# EAGLE design rpi_shield (EAGLE 6.5.0)
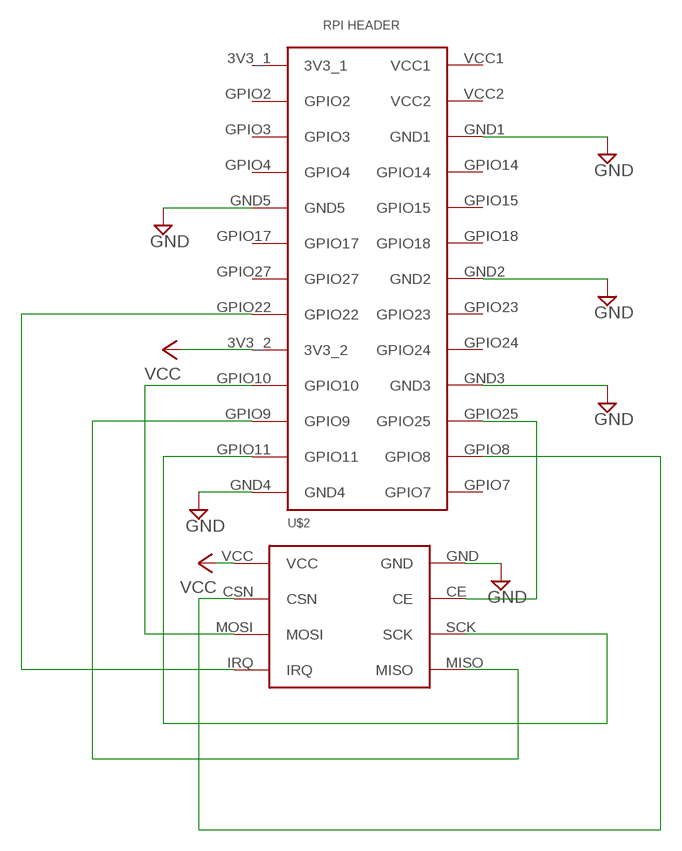
[diagram p0: schematic, sheet 1]

## Parts
U$1  RPI_HEADER  [RPI_HEADER]
U$2  NRF24L01_8P_ANTENNA  [NRF24L01_8P_ANTENNA]

## Nets
GND: U$1.GND1 U$1.GND2 U$1.GND3 U$1.GND4 U$1.GND5 U$2.GND
N$2: U$1.GPIO25 U$2.CE
N$4: U$1.GPIO11 U$2.SCK
N$5: U$1.GPIO9 U$2.MISO
N$6: U$1.GPIO10 U$2.MOSI
N$7: U$1.GPIO22 U$2.IRQ
N$8: U$1.GPIO8 U$2.CSN
VCC: U$1.3V3_2 U$2.VCC
Unconnected: U$1.3V3_1 U$1.GPIO2 U$1.GPIO3 U$1.GPIO4 U$1.GPIO7 U$1.GPIO14 U$1.GPIO15 U$1.GPIO17 U$1.GPIO18 U$1.GPIO23 U$1.GPIO24 U$1.GPIO27 U$1.VCC1 U$1.VCC2

## Library data of the parts
U$1 = piweather:RPI_HEADER
U$2 = piweather:NRF24L01_8P_ANTENNA

## Board
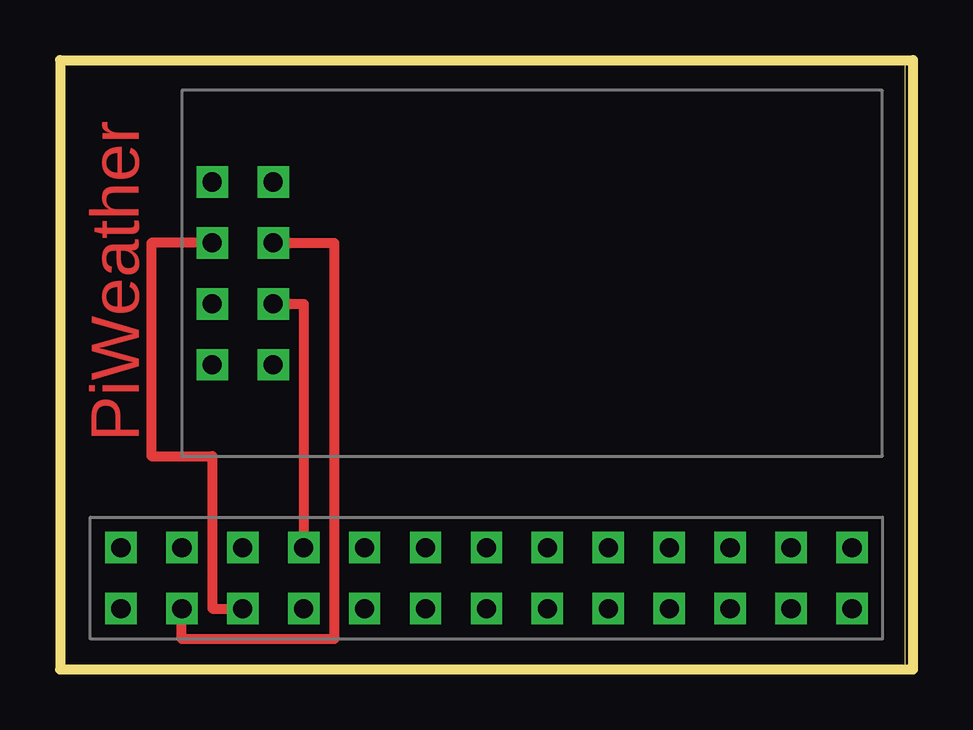
[diagram p1: board, top side]
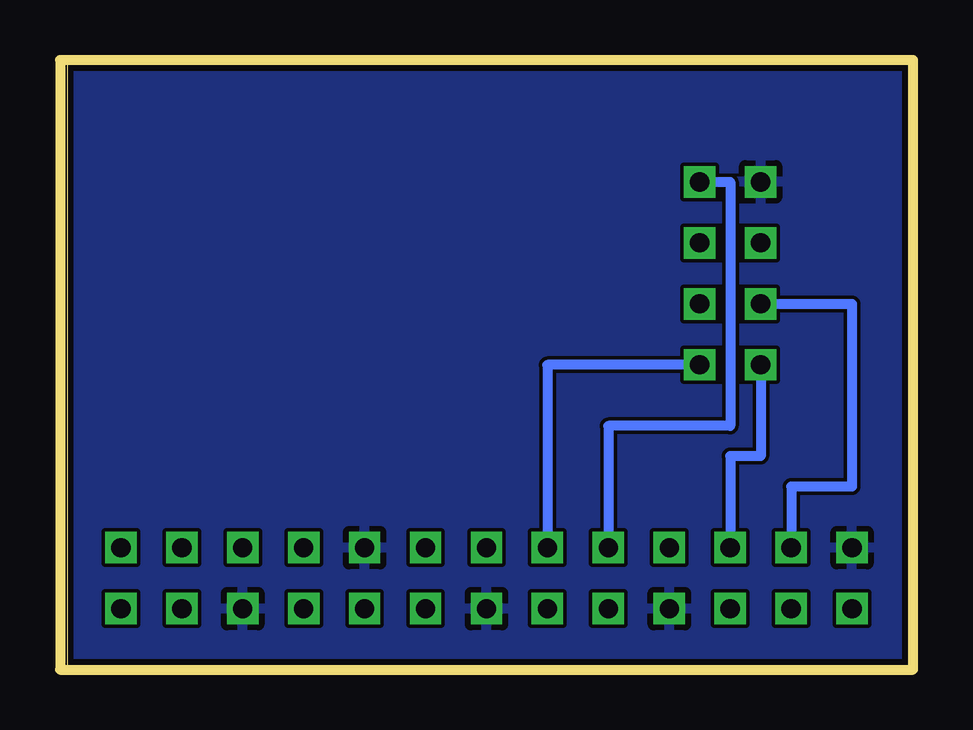
[diagram p2: board, bottom side, seen from below]

Size 35.56 x 25.4 mm. Coordinates in mm from the lower left corner, seen from the top.
Outline: 0,0 35.23,0 35.23,25.39 0,25.39 0,0
Outline: 0,0 35.56,0 35.56,25.4 0,25.4 0,0
Copper layers (1*16): Top 0.035mm / dielectric 1.5mm / Bottom 0.035mm
Design rules "SeeedStudio_2layer_DRU_no_angle_20140221": minimum track width 6mil, minimum drill 12mil, track to track 6mil, track to pad 6mil, pad to pad 6mil, via to via 6mil, smd to smd 0mil, copper to edge 10mil, drill to drill 10mil, minimum pad ring 10mil, minimum via ring 6mil, stop-mask expansion 2mil, vias tented up to drill 100mil, thermal gap 10mil

### Footprints (pad centres in the part's own frame; a part is rotated, then mirrored left to right if it is on the bottom)
RPI_HEADER = drill 0.8 square: 3V3_1 -1.27,15.24; 3V3_2 -1.27,-5.08; GND1 1.27,10.16; GND2 1.27,0; GND3 1.27,-7.62; GND4 -1.27,-15.24; GND5 -1.27,5.08; GPIO2 -1.27,12.7; GPIO3 -1.27,10.16; GPIO4 -1.27,7.62; GPIO7 1.27,-15.24; GPIO8 1.27,-12.7; GPIO9 -1.27,-10.16; GPIO10 -1.27,-7.62; GPIO11 -1.27,-12.7; GPIO14 1.27,7.62; GPIO15 1.27,5.08; GPIO17 -1.27,2.54; GPIO18 1.27,2.54; GPIO22 -1.27,-2.54; GPIO23 1.27,-2.54; GPIO24 1.27,-5.08; GPIO25 1.27,-10.16; GPIO27 -1.27,0; VCC1 1.27,15.24; VCC2 1.27,12.7
NRF24L01_8P_ANTENNA = drill 0.8 square: CE -13.97,1.27; CSN -11.43,1.27; GND -13.97,3.81; IRQ -11.43,-3.81; MISO -13.97,-3.81; MOSI -11.43,-1.27; SCK -13.97,-1.27; VCC -11.43,3.81

### Placement (x,y rotation side)
U$1  17.78,3.81 270 top
U$2  20.32,16.51 0 top

### Tracks (layer width: path | path; a pad name or v marks a point on that pad's centre or on a via)
GND
  pour Bottom: 0,25.4 35.56,25.4 35.56,0 0,0
N$2
  Top 0.406: U$2.CE 3.81,17.78 3.81,8.89 6.35,8.89 6.35,2.54 U$1.GPIO25
N$4
  Bottom 0.406: U$2.SCK 2.54,15.24 2.54,7.62 5.08,7.62 U$1.GPIO11
N$5
  Bottom 0.406: U$2.MISO 6.35,8.89 7.62,8.89 U$1.GPIO9
N$6
  Top 0.406: U$2.MOSI 10.16,15.24 U$1.GPIO10
N$7
  Bottom 0.406: U$2.IRQ 15.24,12.7 U$1.GPIO22
N$8
  Top 0.406: U$2.CSN 11.43,17.78 11.43,1.27 5.08,1.27 U$1.GPIO8
VCC
  Bottom 0.406: U$2.VCC 7.62,20.32 7.62,10.16 12.7,10.16 U$1.3V3_2

### Text on the board
Top: PiWeather